# Altium schematic sheet Fuse.SchDoc
size A2
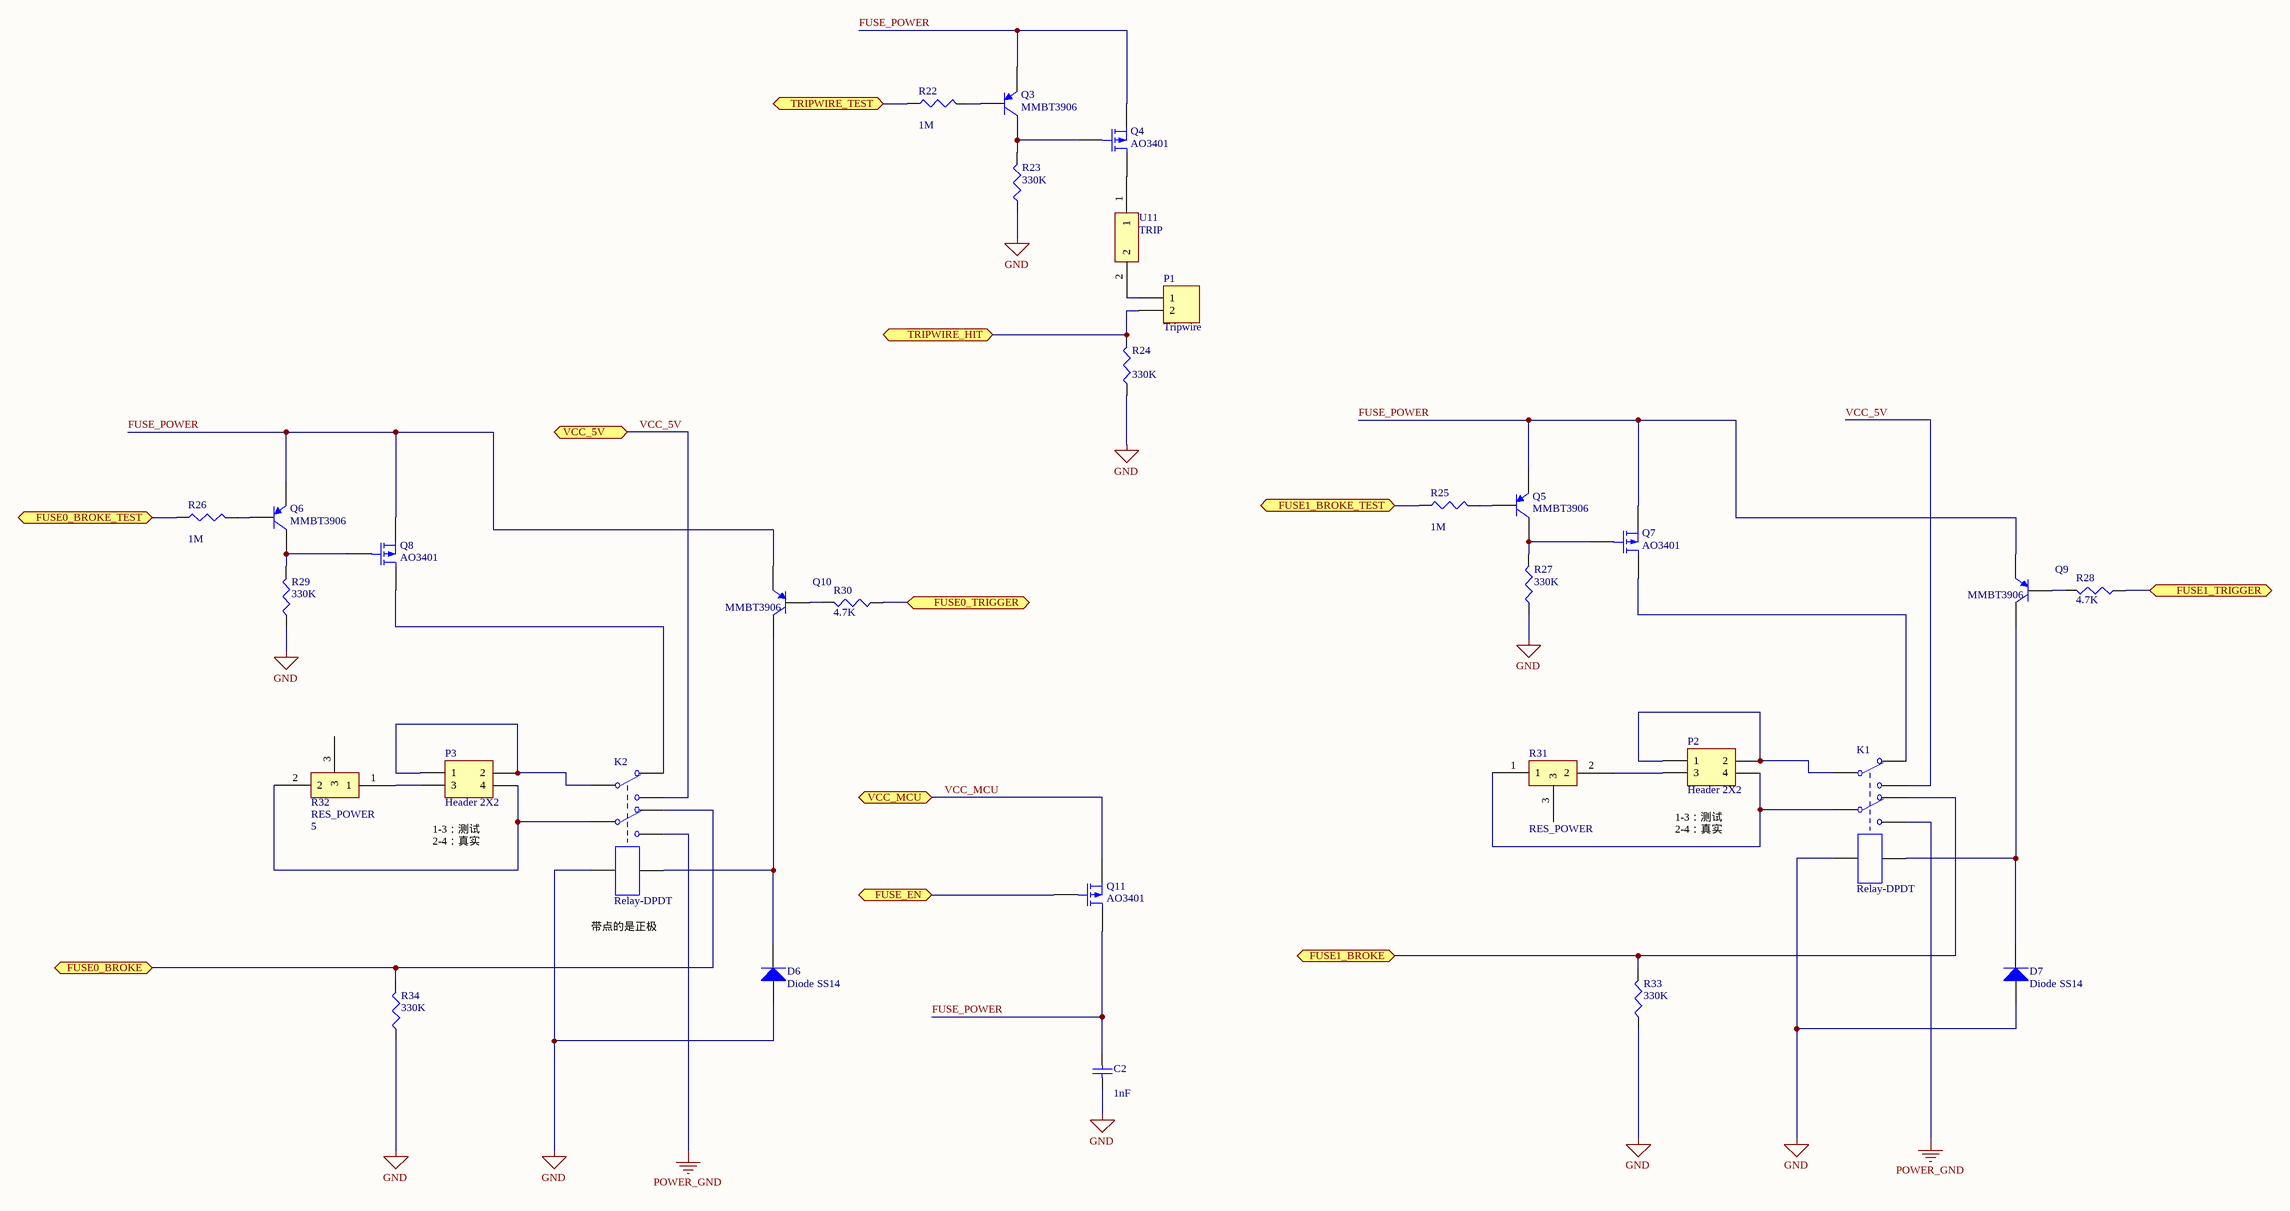
[diagram p0: Fuse.SchDoc]

## Parts
C2  value 1nF  [0603]  (hidden comment: Cap Semi)
D6  Diode SS14  [SMA]
D7  Diode SS14  [SMA]
K1  Relay-DPDT  [G6K2PY]
K2  Relay-DPDT  [G6K2PY]
P1  Tripwire  [HDR1X2]
P2  Header 2X2  [HDR2X2]
P3  Header 2X2  [HDR2X2]
Q3  MMBT3906  [SOT23-3-PNP]
Q4  AO3401  [SOT23-3-PMOS]
Q5  MMBT3906  [SOT23-3-PNP]
Q6  MMBT3906  [SOT23-3-PNP]
Q7  AO3401  [SOT23-3-PMOS]
Q8  AO3401  [SOT23-3-PMOS]
Q9  MMBT3906  [SOT23-3-PNP]
Q10  MMBT3906  [SOT23-3-PNP]
Q11  AO3401  [SOT23-3-PMOS]
R22  value 1M  [0603]  (hidden comment: Res3)
R23  value 330K  [0603]  (hidden comment: Res3)
R24  value 330K  [0603]  (hidden comment: Res3)
R25  value 1M  [0603]  (hidden comment: Res3)
R26  value 1M  [0603]  (hidden comment: Res3)
R27  value 330K  [0603]  (hidden comment: Res3)
R28  value 4.7K  [0603]  (hidden comment: Res3)
R29  value 330K  [0603]  (hidden comment: Res3)
R30  value 4.7K  [0603]  (hidden comment: Res3)
R31  RES_POWER  [RES_POWER]
R32  RES_POWER  value 5  [RES_POWER]
R33  value 330K  [0603]  (hidden comment: Res3)
R34  value 330K  [0603]  (hidden comment: Res3)
U11  TRIP  [TRIP]

## Ports
FUSE0_BROKE (bidir), FUSE0_BROKE_TEST (bidir), FUSE0_TRIGGER (bidir), FUSE1_BROKE (bidir), FUSE1_BROKE_TEST (bidir), FUSE1_TRIGGER (bidir), FUSE_EN (bidir), TRIPWIRE_HIT (bidir), TRIPWIRE_TEST (bidir), VCC_5V (bidir), VCC_MCU (bidir)

## Nets
GND: C2.1 D6.1(A) D7.1(A) K1.7 K2.7 R23.1 R24.1 R27.1 R29.1 R33.1 R34.1
POWER_GND: K1.6 K2.6
FUSE0_BROKE: K2.5 R34.2 ; port FUSE0_BROKE
FUSE0_BROKE_TEST: R26.1 ; port FUSE0_BROKE_TEST
FUSE0_TRIGGER: R30.1 ; port FUSE0_TRIGGER
FUSE1_BROKE: K1.5 R33.2 ; port FUSE1_BROKE
FUSE1_BROKE_TEST: R25.1 ; port FUSE1_BROKE_TEST
FUSE1_TRIGGER: R28.1 ; port FUSE1_TRIGGER
FUSE_EN: Q11.2(G) ; port FUSE_EN
FUSE_POWER: C2.2 Q3.3(E) Q4.3(S) Q5.3(E) Q6.3(E) Q7.3(S) Q8.3(S) Q9.3(E) Q10.3(E) Q11.1(D)
TRIPWIRE_HIT: P1.2 R24.2 ; port TRIPWIRE_HIT
TRIPWIRE_TEST: R22.1 ; port TRIPWIRE_TEST
VCC_5V: K1.3 K2.3 ; port VCC_5V
VCC_MCU: Q11.3(S) ; port VCC_MCU
NetD6_2: D6.2(K) K2.8 Q10.1(C)
NetD7_2: D7.2(K) K1.8 Q9.1(C)
NetK1_1: K1.1 P2.1 P2.2
NetK1_2: K1.2 Q7.1(D)
NetK1_4: K1.4 P2.4 R31.1
NetK2_1: K2.1 P3.1 P3.2
NetK2_2: K2.2 Q8.1(D)
NetK2_4: K2.4 P3.4 R32.2
NetP1_1: P1.1 U11.2
NetP2_3: P2.3 R31.2
NetP3_3: P3.3 R32.1
NetQ3_1: Q3.1(C) Q4.2(G) R23.2
NetQ3_2: Q3.2(B) R22.2
NetQ4_1: Q4.1(D) U11.1
NetQ5_1: Q5.1(C) Q7.2(G) R27.2
NetQ5_2: Q5.2(B) R25.2
NetQ6_1: Q6.1(C) Q8.2(G) R29.2
NetQ6_2: Q6.2(B) R26.2
NetQ9_2: Q9.2(B) R28.2
NetQ10_2: Q10.2(B) R30.2

Not connected (* = marked no-connect by the designer): R31 3; R32 3

## Notes on the sheet
- (near P3) 1-3：测试
  2-4：真实
- (near P2) 1-3：测试
  2-4：真实
- 带点的是正极

## Library data of the parts
C2 = Cap Semi: Capacitor (Semiconductor SIM Model); Published: 8-Jun-2000; LatestRevisionDate: 29-May-2009; LatestRevisionNote: IPC-7351 Footprint Added.; PackageReference: C1206; Publisher: Altium Limited; PackageDescription: Chip Capacitor
D6 D7 = Diode 1N4005: 1 Amp General Purpose Rectifier; Published: 8-Jun-2000; LatestRevisionDate: 17-Jul-2002; LatestRevisionNote: Re-released for DXP Platform.; DatasheetVersion: 1998; PackageVersion: Aug-1999; PackageReference: DO-41; Publisher: Altium Limited; PackageDescription: Diode, Axial; Body 5.2 x 2.7 mm (LxDia. max), Lead Dia. 0.86 mm (max); Code_JEDEC: DO-204-AL; ComponentLink1Description: Manufacturer Link; ComponentLink1URL: http://www.fairchildsemi.com/; ComponentLink2Description: Datasheet; ComponentLink2URL: http://www.fairchildsemi.com/ds/1N%2F1N4001.pdf
K1 K2 = Relay-DPDT: Dual-Pole Dual-Throw Relay; Published: 24-Mar-1999; LatestRevisionDate: 17-Jul-2002; LatestRevisionNote: Re-released for DXP Platform.; PackageReference: DIP-P8; Publisher: Altium Limited; PackageDescription: Relay; 8 Leads
P1 = Header 2: Header, 2-Pin; LatestRevisionDate: 17-Jul-2002; LatestRevisionNote: Re-released for DXP Platform.; Publisher: Altium Limited
P2 P3 = Header 2X2: Header, 2-Pin, Dual row; LatestRevisionDate: 17-Jul-2002; LatestRevisionNote: Re-released for DXP Platform.; Publisher: Altium Limited
Q3 Q5 Q6 Q9 Q10 = PNP: PNP Bipolar Transistor; Published: 8-Jun-2000; LatestRevisionDate: 29-May-2009; LatestRevisionNote: IPC-7351 Footprint Added.; PackageVersion: Aug-1999; PackageReference: SOT-23B; Publisher: Altium Limited; PackageDescription: 3-Pin SOT-23 Package 0.95 mm Pitch, 2.4 mm Lead Span
Q4 Q7 Q8 Q11 = MOSFET-P: P-Channel MOSFET; Published: 8-Jun-2000; LatestRevisionDate: 17-Jul-2002; LatestRevisionNote: Re-released for DXP Platform.; PackageVersion: 1995/1996; PackageReference: E3; Publisher: Altium Limited; PackageDescription: TO, Flat Index; 3 In-Line, Axial Leads; Body Dia. 4.6mm; Lead Dia. 0.5 mm (max)
R22-R30 R33 R34 = Res3: Resistor; Published: 8-Jun-2000; LatestRevisionDate: 29-May-2009; LatestRevisionNote: IPC-7351 Footprint Added.; PackageReference: J1-0603; Publisher: Altium Limited; PackageDescription: Chip Resistor
R31 = RES_POWER: Value: 5